# Altium schematic sheet main.SchDoc: AR488-Nano
size 420 x 297 mm; Date: 2021-12-08; Author: Joachim Löfwander; Revision: AAA-000; SheetNumber: 1; SheetTotal: 1; Website: github.com/jlofw
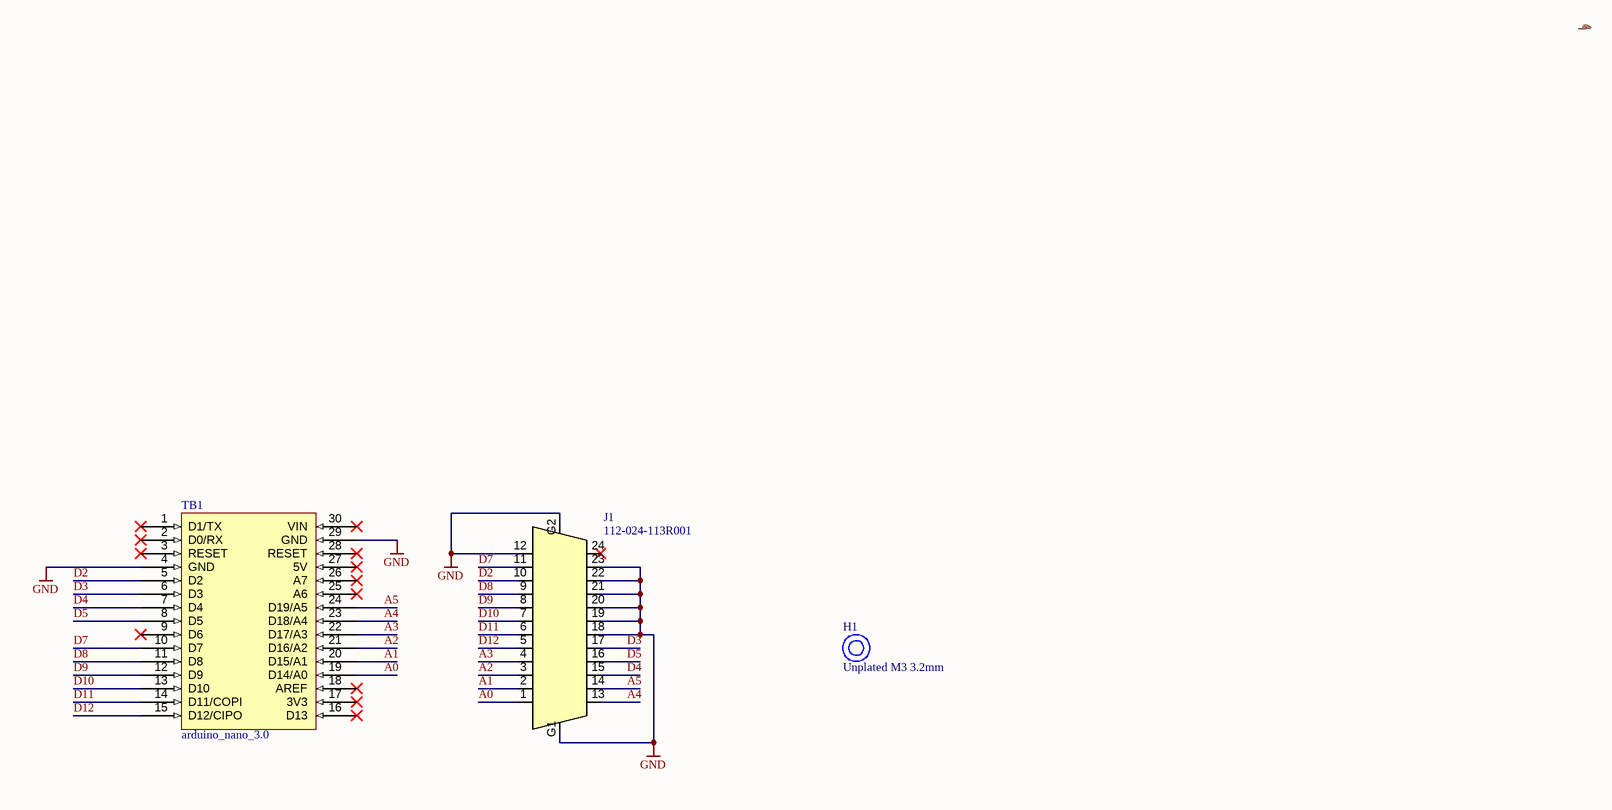
[diagram p0: main.SchDoc]

## Parts
H1  Unplated M3 3.2mm  [MountingHole_3.2mm_M3_NPTH]  (no BOM)
J1  Manufacturer A P/N: 112-024-113R001  [NorComp_112-024-113R001]  (hidden comment: NorComp_112-024-113R001)
logo1  beaver  [beaver]  (value not drawn)  (no BOM)
TB1  arduino_nano_3.0  [arduino_nano]

## Nets
GND: J1.12 J1.18 J1.19 J1.20 J1.21 J1.22 J1.23 J1.G1 J1.G2 TB1.4(GND) TB1.29(GND)
A0: J1.1 TB1.19(D14/A0)
A1: J1.2 TB1.20(D15/A1)
A2: J1.3 TB1.21(D16/A2)
A3: J1.4 TB1.22(D17/A3)
A4: J1.13 TB1.23(D18/A4)
A5: J1.14 TB1.24(D19/A5)
D2: J1.10 TB1.5(D2)
D3: J1.17 TB1.6(D3)
D4: J1.15 TB1.7(D4)
D5: J1.16 TB1.8(D5)
D7: J1.11 TB1.10(D7)
D8: J1.9 TB1.11(D8)
D9: J1.8 TB1.12(D9)
D10: J1.7 TB1.13(D10)
D11: J1.6 TB1.14(D11/COPI)
D12: J1.5 TB1.15(D12/CIPO)

Not connected (* = marked no-connect by the designer): J1 24*; TB1 1(D1/TX)* 2(D0/RX)* 3(RESET)* 9(D6)* 16(D13)* 17(3V3)* 18(AREF)* 25(A6)* 26(A7)* 27(5V)* 28(RESET)* 30(VIN)*

## Notes on the sheet
- PROJECT
- TITLE
- FILE NAME
- DATE MODIFIED
- SHEET
- REV
- OF
- AUTHOR
- WEBSITE

## Library data of the parts
H1 = 18003: Internal Number: 18003
J1 = 110030: I/O-kontaktdon 24P Centronics male R/A dip solder; Internal Number: 110030; Manufacturer A: NorComp
logo1 = 18008: Internal Number: 18008
TB1 = 130004: Arduino Nano 3.0; Internal Number: 130004